# EAGLE board mcat-4cu-b-v2e (EAGLE 6.5.0)
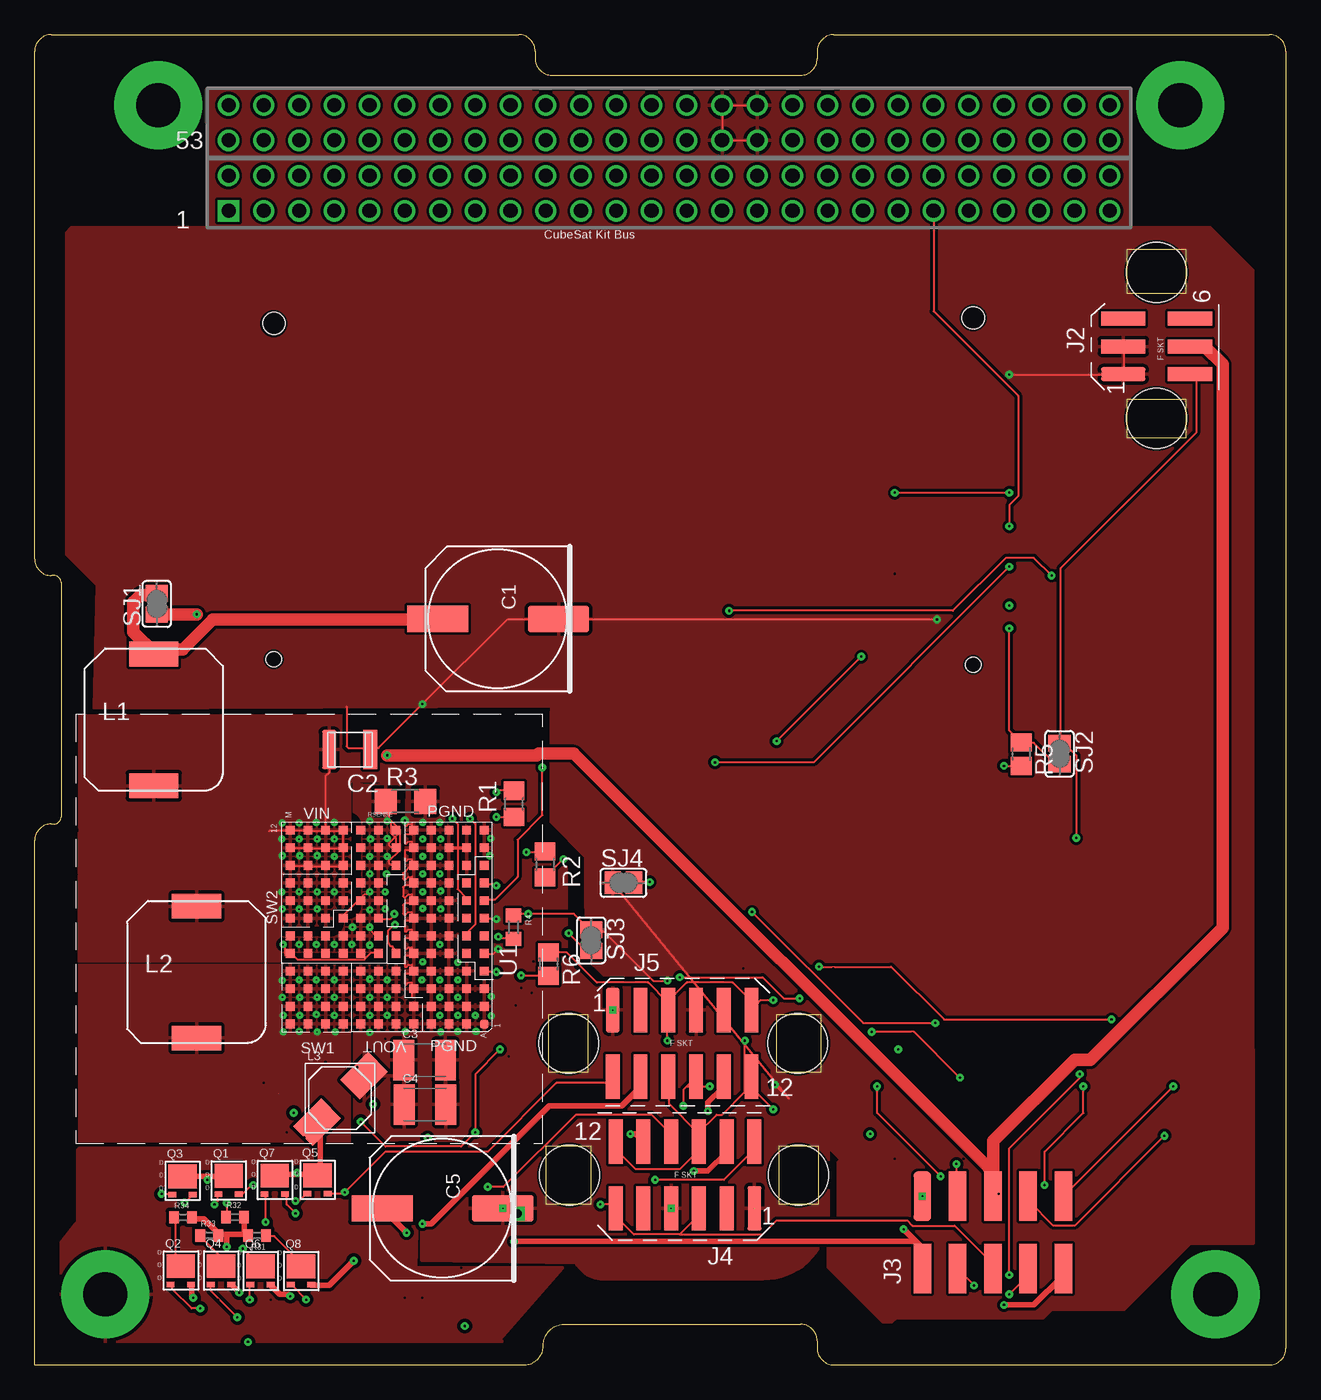
[diagram p5: board, top side]
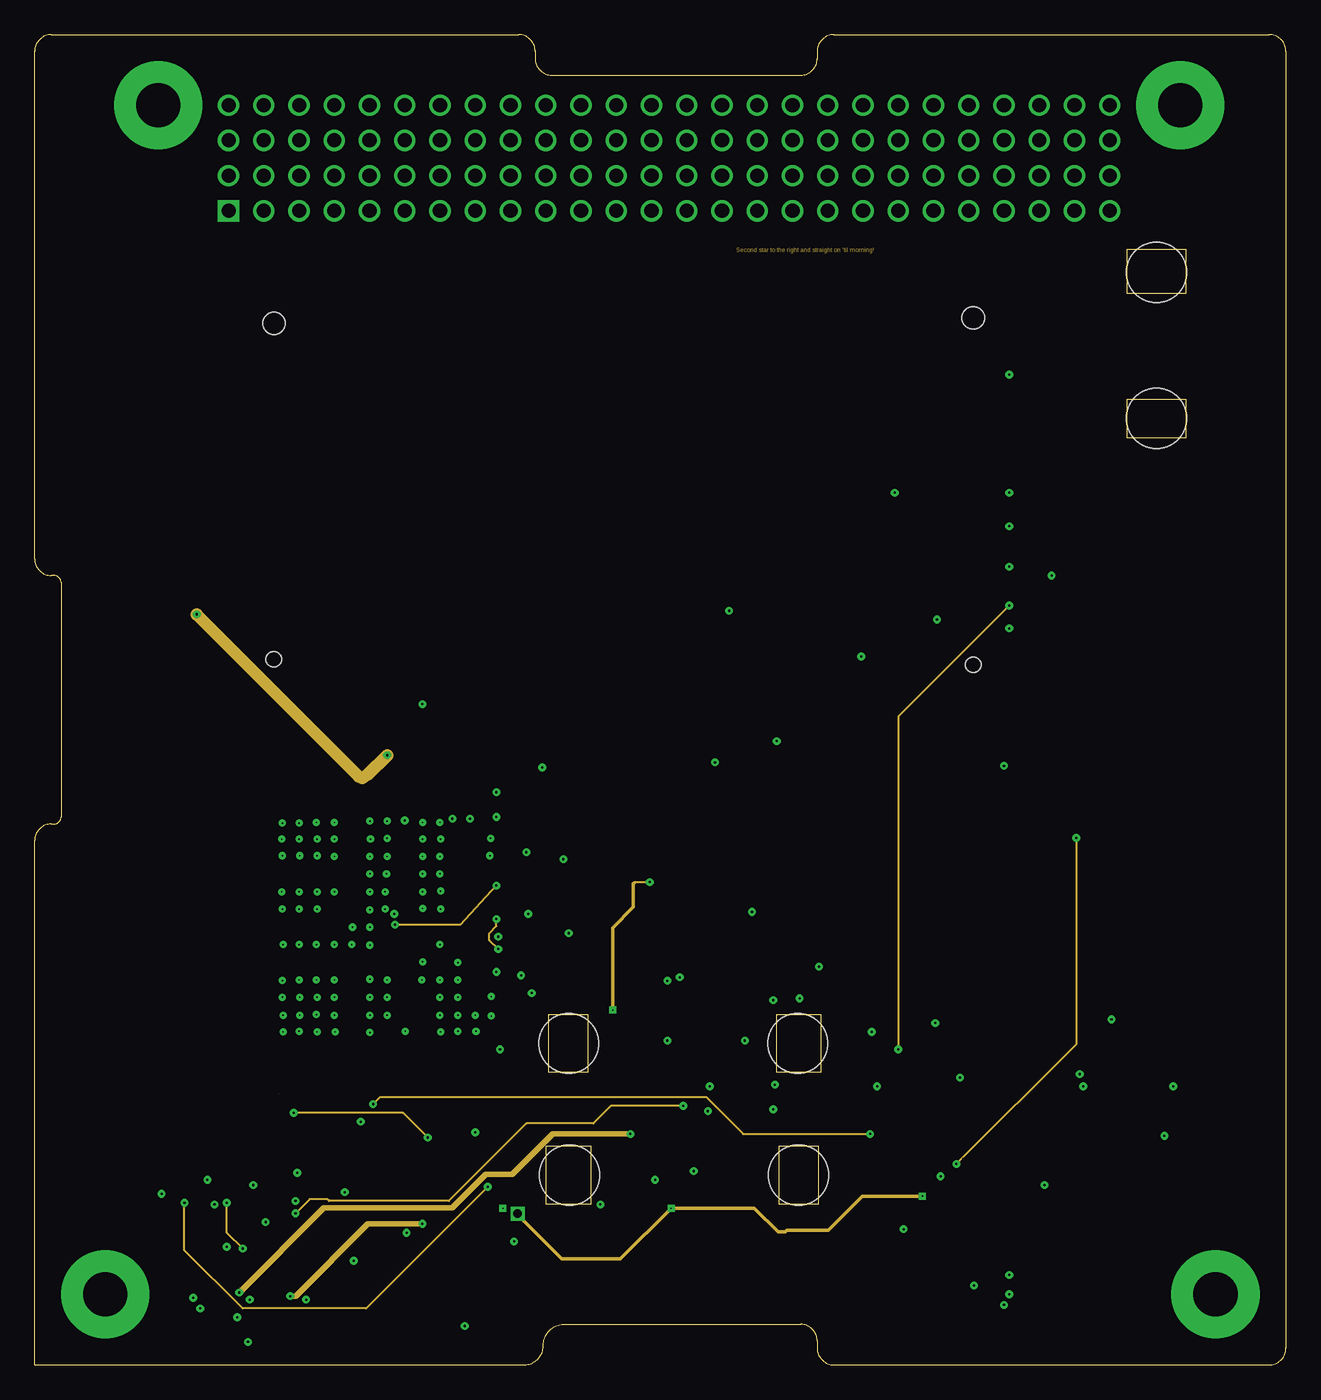
[diagram p6: board, inner layer Route2]
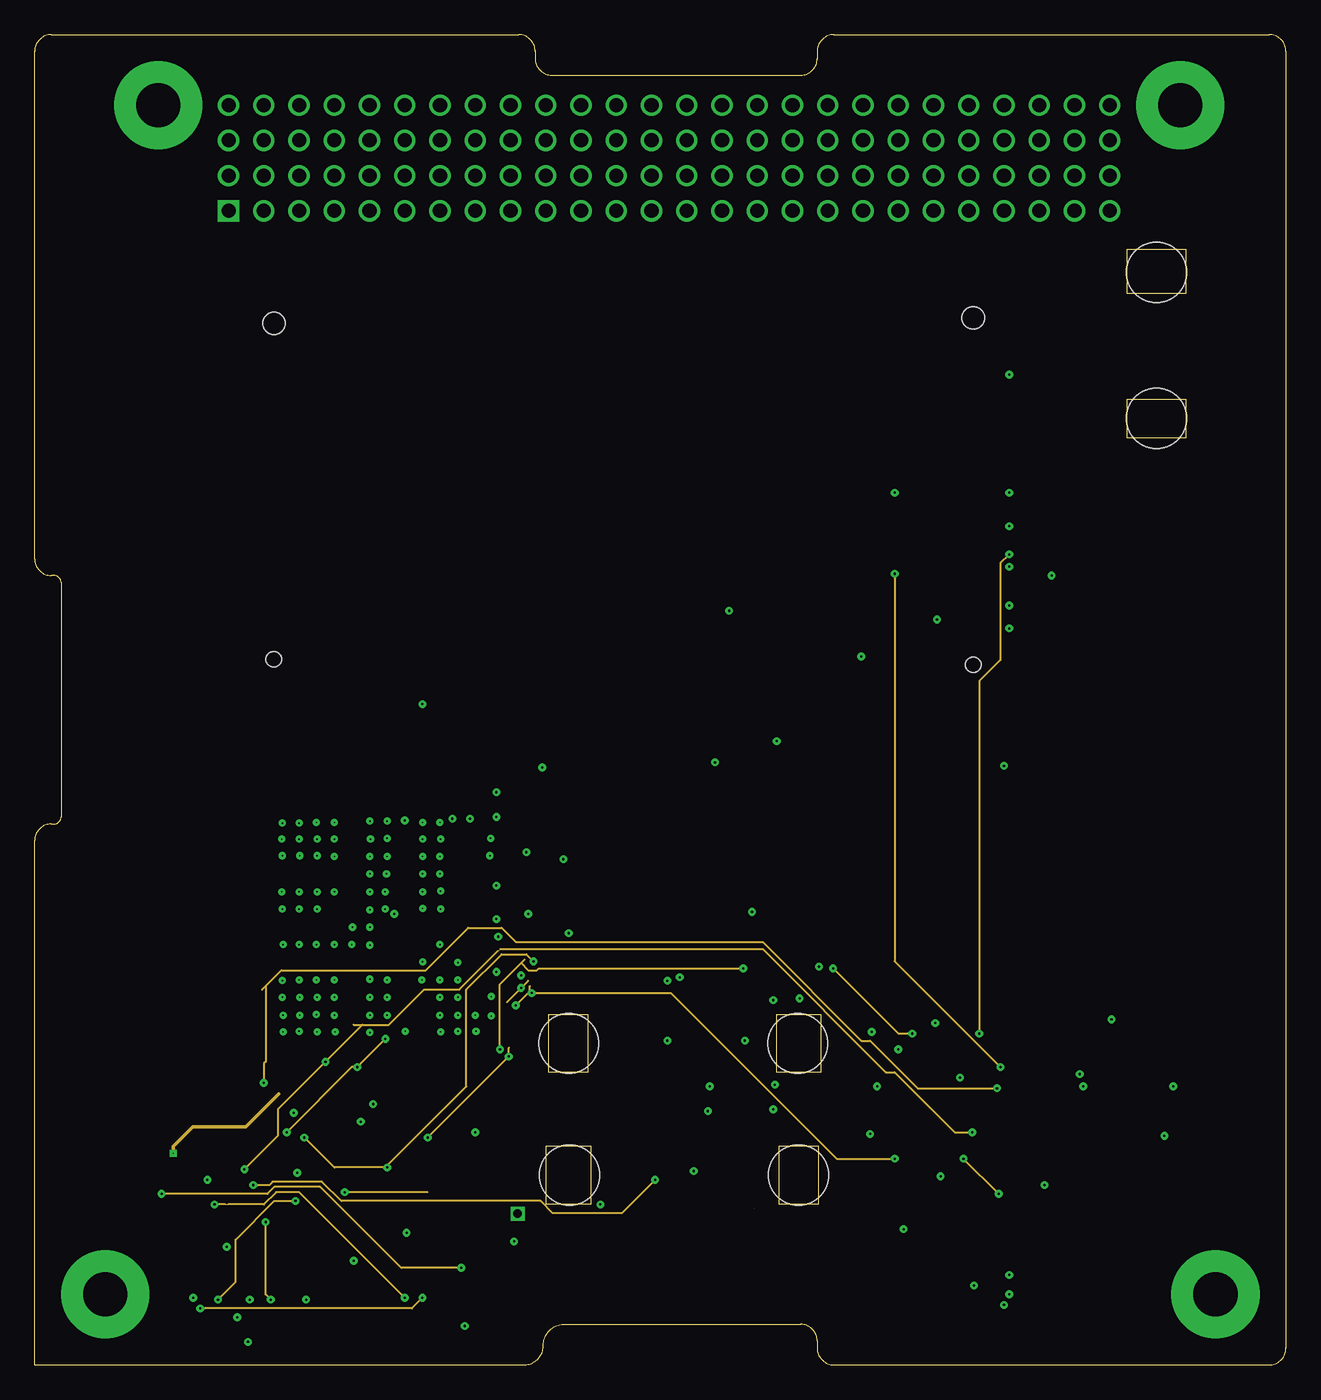
[diagram p7: board, inner layer Route15]
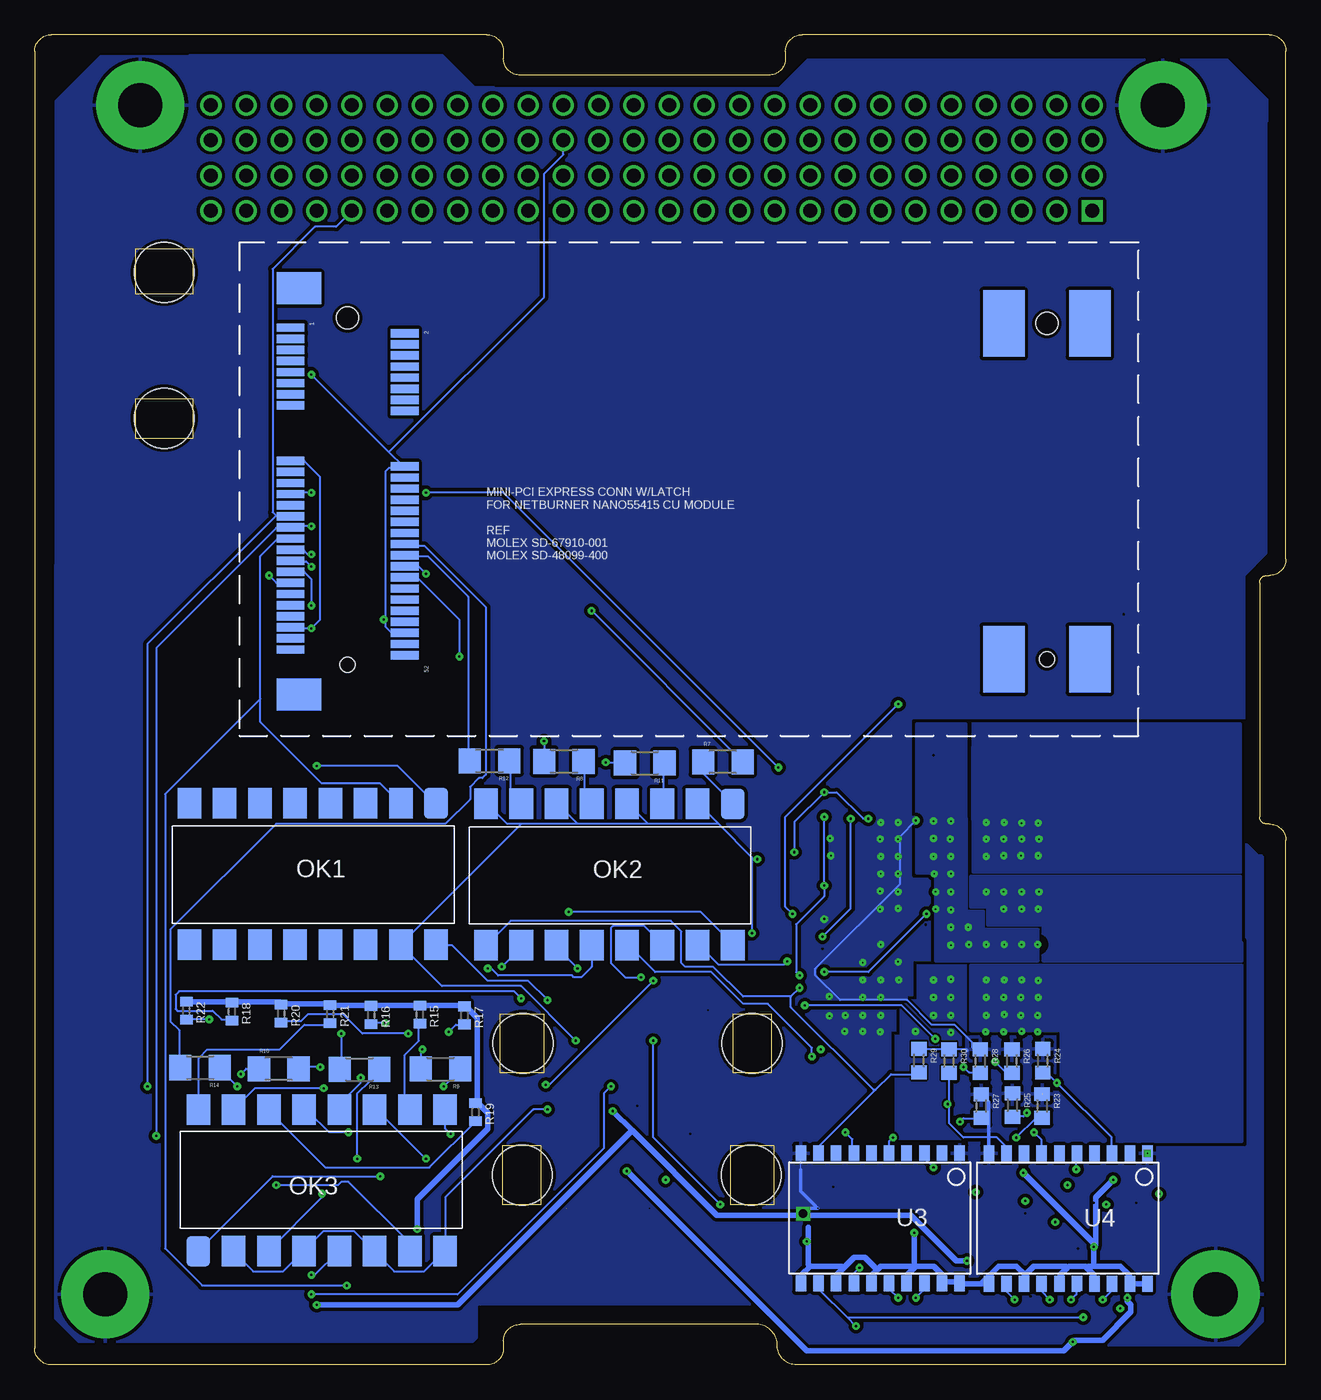
[diagram p8: board, bottom side, seen from below]

Size 90.17 x 95.89 mm. Coordinates in mm from the lower left corner, seen from the top.
Outline: 0,0 34.87,0 35.28,0 arc90 36.65,1.37 arc-90 38.12,2.92 55.19,2.92 arc-90 56.39,1.73 56.39,1.19 arc90 57.58,0 88.98,0 arc90 90.17,1.19 90.17,94.69 arc90 88.98,95.89 57.58,95.89 arc90 56.39,94.69 56.39,94.16 arc-90 55.19,92.96 37.26,92.96 arc-90 36.07,94.16 36.07,94.69 arc90 34.87,95.89 1.19,95.89 arc90 0,94.69 0,58.09 arc90 1.19,56.9 1.4,56.9 arc-90 1.91,56.39 1.91,39.5 arc-90 1.4,38.99 1.19,38.99 arc90 0,37.8 0,0
Copper layers [2:(1+(2*15)+16):15]: Top 0.035559375mm / dielectric 3.5mil / Route2 0.01778125mm / dielectric 47mil / Route15 0.01778125mm / dielectric 3.5mil / Bottom 0.035559375mm
Design rules "mcat-4cu-b-v2e *": minimum track width 6mil, minimum drill 4mil, track to track 6mil, track to pad 6mil, pad to pad 6mil, via to via 6mil, smd to smd 6mil, copper to edge 6.5mil, drill to drill 6.5mil, minimum pad ring 8mil, minimum via ring 8mil, stop-mask expansion 3mil, vias tented up to drill 0mil, thermal gap 10mil
Net classes: 0 default: clearance 0.205 mm; 1 vout1a2ozcu: width 0.406 mm; 2 vin2a2ozcu: width 0.889 mm
tRestrict: 27 lines

## Footprints (pad centres in the part's own frame; a part is rotated, then mirrored left to right if it is on the bottom)
OS-CON-SVPF-F12 = smd 1.9 x 4.4: A1 0,-4.3; K1 0,4.4
MLCC-X7R-1210 = smd 1 x 2.8: 1 1.6,0.05; 2 -1.35,0.05
C1210K = smd 1.5 x 2.9: 1 -1.5,0; 2 1.5,0
CSK_MOUNTING_HOLE = drill 3.175 pad 6.35: P$1 0,0
CSK-BUS-PKG = drill 1.016 pad 1.524 square: 1 -29.21,-3.81 | drill 1.016 pad 1.524: 2 -29.21,-1.27; 3 -26.67,-3.81; 4 -26.67,-1.27; 5 -24.13,-3.81; 6 -24.13,-1.27; 7 -21.59,-3.81; 8 -21.59,-1.27; 9 -19.05,-3.81; 10 -19.05,-1.27; 11 -16.51,-3.81; 12 -16.51,-1.27; 13 -13.97,-3.81; 14 -13.97,-1.27; 15 -11.43,-3.81; 16 -11.43,-1.27; 17 -8.89,-3.81; 18 -8.89,-1.27; 19 -6.35,-3.81; 20 -6.35,-1.27; 21 -3.81,-3.81; 22 -3.81,-1.27; 23 -1.27,-3.81; 24 -1.27,-1.27; 25 1.27,-3.81; 26 1.27,-1.27; 27 3.81,-3.81; 28 3.81,-1.27; 29 6.35,-3.81; 30 6.35,-1.27; 31 8.89,-3.81; 32 8.89,-1.27; 33 11.43,-3.81; 34 11.43,-1.27; 35 13.97,-3.81; 36 13.97,-1.27; 37 16.51,-3.81; 38 16.51,-1.27; 39 19.05,-3.81; 40 19.05,-1.27; 41 21.59,-3.81; 42 21.59,-1.27; 43 24.13,-3.81; 44 24.13,-1.27; 45 26.67,-3.81; 46 26.67,-1.27; 47 29.21,-3.81; 48 29.21,-1.27; 49 31.75,-3.81; 50 31.75,-1.27; 51 34.29,-3.81; 52 34.29,-1.27; 53 -29.21,1.27; 54 -29.21,3.81; 55 -26.67,1.27; 56 -26.67,3.81; 57 -24.13,1.27; 58 -24.13,3.81; 59 -21.59,1.27; 60 -21.59,3.81; 61 -19.05,1.27; 62 -19.05,3.81; 63 -16.51,1.27; 64 -16.51,3.81; 65 -13.97,1.27; 66 -13.97,3.81; 67 -11.43,1.27; 68 -11.43,3.81; 69 -8.89,1.27; 70 -8.89,3.81; 71 -6.35,1.27; 72 -6.35,3.81; 73 -3.81,1.27; 74 -3.81,3.81; 75 -1.27,1.27; 76 -1.27,3.81; 77 1.27,1.27; 78 1.27,3.81; 79 3.81,1.27; 80 3.81,3.81; 81 6.35,1.27; 82 6.35,3.81; 83 8.89,1.27; 84 8.89,3.81; 85 11.43,1.27; 86 11.43,3.81; 87 13.97,1.27; 88 13.97,3.81; 89 16.51,1.27; 90 16.51,3.81; 91 19.05,1.27; 92 19.05,3.81; 93 21.59,1.27; 94 21.59,3.81; 95 24.13,1.27; 96 24.13,3.81; 97 26.67,1.27; 98 26.67,3.81; 99 29.21,1.27; 100 29.21,3.81; 101 31.75,1.27; 102 31.75,3.81; 103 34.29,1.27; 104 34.29,3.81
M80-68106 = smd 1 x 3.2: 1 -2,2.4; 2 0,2.4; 3 2,2.4; 4 -2,-2.4; 5 0,-2.4; 6 2,-2.4 | hole 4.318: -5.175,0; 5.335,0
AMPMODU-SMT-PIN-HEADER-5X2 = smd 1.27 x 3.556: 1 -4.826,2.54; 2 -2.286,2.54; 3 0.254,2.54; 4 2.794,2.54; 5 5.334,2.54; 6 -4.826,-2.667; 7 -2.286,-2.667; 8 0.254,-2.667; 9 2.794,-2.667; 10 5.334,-2.667
M80-68112 = smd 1 x 3.2: 1 0,2.4; 2 2,2.4; 3 4,2.4; 4 6,2.4; 5 8,2.4; 6 10,2.4; 7 0,-2.4; 8 2,-2.4; 9 4,-2.4; 10 6,-2.4; 11 8,-2.4; 12 10,-2.4 | hole 4.318: -3.175,0; 13.335,0
MSS1048 = smd 3.56 x 1.78: 1 5,9.85; 2 5,0.35
SERIES-POWER-INDUCTORS = smd 2.85 x 2 rotated 45: 1 1.75,1.6; 2 -1.65,-1.75
PS2501L-4 = smd 2.2 x 1.7: 1 -1.6,19.03; 2 -1.6,16.49; 3 -1.6,13.95; 4 -1.6,11.41; 5 -1.6,8.87; 6 -1.6,6.33; 7 -1.6,3.79; 8 -1.6,1.25; 9 8.6,1.25; 10 8.6,3.79; 11 8.6,6.33; 12 8.6,8.87; 13 8.6,11.41; 14 8.6,13.95; 15 8.6,16.49; 16 8.6,19.03
1206-8-CHIPFET = smd 2.032 x 1.727: D 0,1.321 | smd 0.559 x 0.406: G -0.736,0; S 0.736,0
R0805 = smd 1.3 x 1.5: 1 -0.95,0; 2 0.95,0
R1206 = smd 1.6 x 1.803: 1 -1.422,0; 2 1.422,0
R0603 = smd 1 x 1.1: 1 -0.85,0; 2 0.85,0
R0805' = smd 1.3 x 1.5: 1 -0.85,0; 2 0.85,0
R0402 = smd 0.7 x 0.9: 1 -0.65,0; 2 0.65,0
SJ = smd 1.168 x 1.6: 1 -0.762,0; 2 0.762,0
LGA-141-LTC-05-08-1840-B = smd 0.63 x 0.63: A1 -7.116,-10.192; A2 -5.846,-10.192; A3 -4.576,-10.192; A4 -3.306,-10.192; A5 -2.036,-10.192; A6 -0.766,-10.192; A7 0.504,-10.192; A8 1.774,-10.192; A9 3.044,-10.192; A10 4.314,-10.192; A11 5.584,-10.192; A12 6.854,-10.192; B1 -7.116,-8.922; B2 -5.846,-8.922; B3 -4.576,-8.922; B4 -3.306,-8.922; B5 -2.036,-8.922; B6 -0.766,-8.922; B7 0.504,-8.922; B8 1.774,-8.922; B9 3.044,-8.922; B10 4.314,-8.922; B11 5.584,-8.922; B12 6.854,-8.922; C1 -7.116,-7.652; C2 -5.846,-7.652; C3 -4.576,-7.652; C4 -3.306,-7.652; C5 -2.036,-7.652; C6 -0.766,-7.652; C7 0.504,-7.652; C8 1.774,-7.652; C9 3.044,-7.652; C10 4.314,-7.652; C11 5.584,-7.652; C12 6.854,-7.652; D1 -7.116,-6.382; D2 -5.846,-6.382; D3 -4.576,-6.382; D4 -3.306,-6.382; D5 -2.036,-6.382; D6 -0.766,-6.382; D7 0.504,-6.382; D8 1.774,-6.382; D9 3.044,-6.382; D10 4.314,-6.382; D11 5.584,-6.382; D12 6.854,-6.382; E1 -7.116,-5.112; E2 -5.846,-5.112; E3 -4.576,-5.112; E4 -3.306,-5.112; E5 -2.036,-5.112; E6 -0.766,-5.112; E7 0.504,-5.112; E8 1.774,-5.112; E9 3.044,-5.112; E10 4.314,-5.112; E11 5.584,-5.112; E12 6.854,-5.112; F1 -7.116,-3.842; F2 -5.846,-3.842; F3 -4.576,-3.842; F4 -3.306,-3.842; F5 -2.036,-3.842; F6 -0.766,-3.842; F10 4.314,-3.842; F11 5.584,-3.842; F12 6.854,-3.842; G1 -7.116,-2.572; G2 -5.846,-2.572; G3 -4.576,-2.572; G4 -3.306,-2.572; G5 -2.036,-2.572; G6 -0.766,-2.572; G7 0.504,-2.572; G8 1.774,-2.572; G9 3.044,-2.572; G10 4.314,-2.572; G11 5.584,-2.572; G12 6.854,-2.572; H2 -5.846,-1.302; H3 -4.576,-1.302; H4 -3.306,-1.302; H5 -2.036,-1.302; H6 -0.766,-1.302; H7 0.504,-1.302; H8 1.774,-1.302; H9 3.044,-1.302; H10 4.314,-1.302; H11 5.584,-1.302; H12 6.854,-1.302; J5 -2.036,-0.032; J6 -0.766,-0.032; J7 0.504,-0.032; J8 1.774,-0.032; J9 3.044,-0.032; J10 4.314,-0.032; J11 5.584,-0.032; J12 6.854,-0.032; K5 -2.036,1.238; K6 -0.766,1.238; K7 0.504,1.238; K8 1.774,1.238; K9 3.044,1.238; K10 4.314,1.238; K11 5.584,1.238; K12 6.854,1.238; L5 -2.036,2.508; L6 -0.766,2.508; L7 0.504,2.508; L8 1.774,2.508; L9 3.044,2.508; L10 4.314,2.508; L11 5.584,2.508; L12 6.854,2.508; M5 -2.036,3.778; M6 -0.766,3.778; M7 0.504,3.778; M8 1.774,3.778; M9 3.044,3.778; M10 4.314,3.778; M11 5.584,3.778; M12 6.854,3.778; SW1@J1 -7.116,-0.032; SW1@J2 -5.846,-0.032; SW1@J3 -4.576,-0.032; SW1@J4 -3.306,-0.032; SW1@K1 -7.116,1.238; SW1@K2 -5.846,1.238; SW1@K3 -4.576,1.238; SW1@K4 -3.306,1.238; SW1@L1 -7.116,2.508; SW1@L2 -5.846,2.508; SW1@L3 -4.576,2.508; SW1@L4 -3.306,2.508; SW1@M1 -7.116,3.778; SW1@M2 -5.846,3.778; SW1@M3 -4.576,3.778; SW1@M4 -3.306,3.778; VOUT -7.116,-1.302
MOLEX-MINI-PCI-EXPRESS-8MM-52CKT = smd 0.6 x 2: 1 -11.65,-26.8; 2 -11.248,-18.576; 3 -10.85,-26.8; 4 -10.447,-18.576; 5 -10.05,-26.8; 6 -9.648,-18.576; 7 -9.25,-26.8; 8 -8.848,-18.576; 9 -8.45,-26.8; 10 -8.047,-18.576; 11 -7.65,-26.8; 12 -7.247,-18.576; 13 -6.85,-26.8; 14 -6.447,-18.576; 15 -6.05,-26.8; 16 -5.647,-18.576; 17 -2.05,-26.8; 18 -1.647,-18.576; 19 -1.25,-26.8; 20 -0.848,-18.576; 21 -0.45,-26.8; 22 -0.048,-18.576; 23 0.35,-26.8; 24 0.752,-18.576; 25 1.15,-26.8; 26 1.552,-18.576; 27 1.95,-26.8; 28 2.353,-18.576; 29 2.75,-26.8; 30 3.152,-18.576; 31 3.55,-26.8; 32 3.953,-18.576; 33 4.35,-26.8; 34 4.753,-18.576; 35 5.15,-26.8; 36 5.553,-18.576; 37 5.95,-26.8; 38 6.353,-18.576; 39 6.75,-26.8; 40 7.152,-18.576; 41 7.55,-26.8; 42 7.952,-18.576; 43 8.35,-26.8; 44 8.752,-18.576; 45 9.15,-26.8; 46 9.553,-18.576; 47 9.95,-26.8; 48 10.352,-18.576; 49 10.75,-26.8; 50 11.152,-18.576; 51 11.55,-26.8; 52 11.953,-18.576 | smd 2.3 x 3.2: P$1 -14.5,-26.2; P$2 14.8,-26.2 | smd 4.8 x 3: P$3 12.25,24.6; P$4 -11.95,24.6; P$5 -11.95,30.8; P$6 12.25,30.8 | hole 1.6: -12.35,-22.7; -11.95,27.7 | hole 1.1: 12.65,-22.7; 12.25,27.7
20-LEAD-PLASTIC-SO = smd 0.762 x 1.143: 1 0,0; 2 1.27,0; 3 2.54,0; 4 3.81,0; 5 5.08,0; 6 6.35,0; 7 7.62,0; 8 8.89,0; 9 10.16,0; 10 11.43,0; 11 11.43,9.398; 12 10.16,9.398; 13 8.89,9.398; 14 7.62,9.398; 15 6.35,9.398; 16 5.08,9.398; 17 3.81,9.398; 18 2.54,9.398; 19 1.27,9.398; 20 0,9.398

## Placement (x,y rotation side)
C1  68uF  [OS-CON-SVPF-F12]  33.35,53.77 270 top
C2  4.7uF  [MLCC-X7R-1210]  22.83,44.4 180 top
C3  10uF  [C1210K]  28.1,21.97 0 top
C4  10uF  [C1210K]  28.13,18.76 0 top
C5  68uF  [OS-CON-SVPF-F12]  29.34,11.28 270 top
H1  MOUNT-PAD-ROUNDCSK_MTG_HOLE_A5  [CSK_MOUNTING_HOLE]  8.89,90.81 0 top
H2  MOUNT-PAD-ROUNDCSK_MTG_HOLE_A5  [CSK_MOUNTING_HOLE]  82.55,90.81 0 top
H3  MOUNT-PAD-ROUNDCSK_MTG_HOLE_A5  [CSK_MOUNTING_HOLE]  85.09,5.08 0 top
HBL  MOUNT-PAD-ROUNDCSK_MTG_HOLE_A5  [CSK_MOUNTING_HOLE]  5.08,5.08 0 top
J1  2 x ESQ-126-39-G-D  [CSK-BUS-PKG]  43.18,87 0 top
J2  M80-6810642  [M80-68106]  80.84,73.41 90 top
J3  AMPMODU 5X2 SMT HDR  [AMPMODU-SMT-PIN-HEADER-5X2]  68.79,9.62 0 top
J4  M80-6811242  [M80-68112]  51.87,13.68 180 top
J5  M80-6811242  [M80-68112]  41.66,23.17 0 top
L1  33 uH  [MSS1048]  3.58,41.39 0 top
L2  330 uH  [MSS1048]  6.66,23.2 0 top
L3  10 uH  [SERIES-POWER-INDUCTORS]  21.99,19.23 0 top
OK1  PS2501L-4  [PS2501L-4]  80.28,38.88 270 bottom
OK2  PS2501L-4  [PS2501L-4]  58.9,38.84 270 bottom
OK3  PS2501L-4  [PS2501L-4]  59.34,9.79 90 bottom
Q1  SI5404BDC  [1206-8-CHIPFET]  13.98,12.3 0 top
Q2  SI5404BDC  [1206-8-CHIPFET]  10.53,5.8 0 top
Q3  SI5404BDC  [1206-8-CHIPFET]  10.65,12.27 0 top
Q4  SI5404BDC  [1206-8-CHIPFET]  13.42,5.8 0 top
Q5  SI5404BDC  [1206-8-CHIPFET]  20.38,12.34 0 top
Q6  SI5404BDC  [1206-8-CHIPFET]  16.27,5.77 0 top
Q7  SI5404BDC  [1206-8-CHIPFET]  17.3,12.32 0 top
Q8  SI5404BDC  [1206-8-CHIPFET]  19.19,5.77 0 top
R1  3K79  [R0805]  34.54,40.43 90 top
R2  1K  [R0805]  36.78,36.07 270 top
R3  70 mOhms  [R1206]  26.72,40.62 0 top
R4  4k7 0.1%  [R0603]  34.5,31.54 270 top
R5  1K  [R0805']  71.09,44.03 270 top
R6  604R  [R0805']  37.03,28.89 270 top
R7  5K42  [R1206]  40.58,43.47 0 bottom
R8  5K42  [R1206]  52.04,43.51 180 bottom
R9  5K42  [R1206]  60.94,21.32 180 bottom
R10  5K42  [R1206]  72.59,21.34 0 bottom
R11  5K42  [R1206]  46.21,43.37 180 bottom
R12  5K42  [R1206]  57.4,43.53 180 bottom
R13  5K42 0.1%  [R1206]  66.77,21.3 180 bottom
R14  5K42 0.1%  [R1206]  78.26,21.42 180 bottom
R15  R-US_R0402  [R0402]  62.42,25.24 270 bottom
R16  100K 0.1%  [R0402]  65.92,25.22 270 bottom
R17  100K 0.1%  [R0402]  59.2,25.19 270 bottom
R18  100K 0.1%  [R0402]  75.96,25.46 270 bottom
R19  100K 0.1%  [R0402]  58.41,18.22 270 bottom
R20  100K 0.1%  [R0402]  72.41,25.31 270 bottom
R21  100K 0.1%  [R0402]  68.87,25.28 270 bottom
R22  100K 0.1%  [R0402]  79.24,25.53 270 bottom
R23  51K 0.1%  [R0603]  17.57,18.66 270 bottom
R24  51K 0.1%  [R0603]  17.54,21.92 270 bottom
R25  51K 0.1%  [R0603]  19.71,18.72 270 bottom
R26  51K 0.1%  [R0603]  19.75,21.89 270 bottom
R27  51K 0.1%  [R0603]  21.97,18.65 270 bottom
R28  51K 0.1%  [R0603]  22.04,21.9 270 bottom
R29  51k 0.1%  [R0603]  26.45,21.93 270 bottom
R30  51k 0.1%  [R0603]  24.28,21.89 270 bottom
R31  0.1R 1% PTC  [R0402]  16.02,9.33 180 top
R32  0.1R 1% PTC  [R0402]  14.44,10.66 0 top
R33  0.1R 1% PTC  [R0402]  12.58,9.33 0 top
R34  0.1R 1% PTC  [R0402]  10.68,10.63 0 top
SJ1  0R  [SJ]  8.8,54.85 90 top
SJ2  0R  [SJ]  73.85,44.05 270 top
SJ3  0R  [SJ]  40.1,30.6 270 top
SJ4  0R  [SJ]  42.42,34.75 0 top
U1  LTM4609MPV#PBF  [LGA-141-LTC-05-08-1840-B]  22.2,31.69 90 top
U2  UCAT-4CU-B-CONTROL-UNITNANO55415  [MOLEX-MINI-PCI-EXPRESS-8MM-52CKT]  44.93,63.11 270 bottom
U3  LT1161ISW  [20-LEAD-PLASTIC-SO]  23.52,15.26 180 bottom
U4  LT1161ISW  [20-LEAD-PLASTIC-SO]  9.98,15.25 180 bottom

## Tracks (layer width: path | path; a pad name or v marks a point on that pad's centre or on a via)
CH1_P18H  (via drill 0.15)
  Top 0.406: v11.43,4.83 11.3,4.95 11.3,5.71 Q2.S | v47.5,13.97 48.51,13.97 49.78,15.24 49.78,16 J4.8
  Bottom 0.406: v11.43,4.83 11.43,4.57 11.18,4.32 11.18,3.81 13.21,1.78 15.24,1.78 v15.37,1.65 16,1.02 34.54,1.02 v47.5,13.97
CH1_P18L  (via drill 0.15)
  Top 0.152: v15.75,12.95 15.62,12.95 14.99,12.32 14.73,12.32 Q1.S | v44.7,13.34 49.66,13.34 51.82,15.49 51.82,16 J4.7
  Route15 0.152: v15.75,12.95 16.89,12.95 17.14,13.21 20.7,13.21 22.1,11.81 36.45,11.81 37.34,10.92 42.29,10.92 v44.7,13.34
CH1HG  (via drill 0.15, 0.15 layers 15-16)
  Top 0.152: v11.94,4.06 11.3,4.06 9.91,5.46 9.91,5.71 Q2.G
  Route15 0.152: v11.94,4.06 27.18,4.06 v27.94,4.83
  Bottom 0.152: v27.94,4.83 28.57,5.46 28.57,5.84 U3.16
CH1LG  (via drill 0.15, 0.15 layers 15-16)
  Top 0.152: v12.95,11.56 13.21,11.81 13.21,12.19 Q1.G
  Route15 0.152: v12.95,11.56 16.51,11.56 17.4,12.45 19.05,12.45 v26.67,4.83
  Bottom 0.152: v26.67,4.83 26.16,5.33 26.16,5.84 U3.18
CH1S
  Top 0.152: R34.1 10.16,10.54 10.16,7.49 10.41,7.24 Q2.D
CH2_P18H  (via drill 0.15 layers 1-2)
  Top 0.406: v14.73,5.21 14.22,5.71 Q4.S | v42.93,16.64 43.31,16.64 43.81,16.13 J4.11
  Route2 0.406: v14.73,5.21 20.83,11.3 30.1,11.3 32.51,13.72 34.42,13.72 37.34,16.64 v42.93,16.64
CH2_P18L  (via drill 0.15 layers 1-2)
  Top 0.152: v10.79,11.68 11.3,12.19 Q3.S | v32.64,12.83 33.78,12.83 38.99,18.03 44.45,18.03 45.85,16.64 45.85,16.13 J4.10
  Route2 0.152: v10.79,11.68 10.79,8.26 14.99,4.06 23.88,4.06 v32.64,12.83
CH2HG  (via drill 0.15)
  Top 0.152: v14.61,3.43 12.7,5.33 12.7,5.71 Q4.G
  Bottom 0.152: 31.62,3.43 33.66,5.46 33.66,5.84 U3.12 | 31.62,3.43 v30.99,2.79 | 31.62,3.43 v14.61,3.43
CH2LG  (via drill 0.15, 0.15 layers 15-16)
  Top 0.152: v9.14,12.32 9.91,12.32 Q3.G
  Route15 0.152: v9.14,12.32 16.76,12.32 17.27,12.83 20.57,12.83 26.42,6.99 v30.73,6.99
  Bottom 0.152: v30.73,6.99 31.24,6.48 31.24,5.97 U3.14
CH2S
  Top 0.152: R33.1 11.94,9.27 13.34,7.87 13.34,7.24 Q4.D
CH3_P18H  (via drill 0.15 layers 1-2)
  Top 0.406: v18.41,4.95 18.29,5.08 17.65,5.08 17.02,5.71 Q6.S | v27.94,10.16 28.57,10.16 37.08,18.67 42.29,18.67 43.56,19.94 43.56,20.7 J5.8
  Route2 0.406: v18.41,4.95 18.8,4.95 24,10.16 v27.94,10.16
CH3_P18L  (via drill 0.15)
  Top 0.152: Q5.S 21.21,12.32 22.23,12.32 v22.35,12.45 25.27,15.37 32.64,15.37 37.59,20.32 41.15,20.32 41.53,20.7 J5.7
  Route15 0.152: 28.32,12.45 v22.35,12.45
CH3HG  (via drill 0.15)
  Top 0.152: v15.49,4.7 15.49,5.71 Q6.G
  Bottom 0.152: v15.49,4.7 15.11,5.08 15.11,5.84 U4.16
CH3LG  (via drill 0.15, 0.15 layers 15-16)
  Top 0.152: v18.8,11.81 19.05,11.81 19.56,12.32 Q5.G
  Route15 0.152: v18.8,11.81 17.27,11.81 14.48,9.02 14.48,5.97 v13.21,4.7
  Bottom 0.152: v13.21,4.7 12.57,5.33 12.57,5.84 U4.18
CH3S  (via drill 0.15 layers 1-2)
  Top 0.152: v13.84,11.68 13.84,10.67 R32.1 | v14.99,8.38 16.26,7.11 Q6.D
  Route2 0.152: v13.84,11.68 13.84,9.53 v14.99,8.38
CH4_P18H  (via drill 0.15)
  Top 0.406: v22.99,7.49 21.21,5.71 19.94,5.71 Q8.S | v48.51,18.29 48.51,18.92 49.53,19.94 49.53,20.7 J5.11 | v69.85,4.32 72.01,4.32 74.04,6.35 74.04,6.86 J3.10
  Bottom 0.406: v22.99,7.49 23.75,7.49 27.05,10.79 41.02,10.79 47.12,16.89 | v48.51,18.29 47.12,16.89 | v69.85,4.32 59.69,4.32 47.12,16.89
CH4_P18L  (via drill 0.15, 0.15 layers 1-2)
  Top 0.152: v18.8,10.92 18.16,11.56 18.16,12.32 Q7.S | v46.74,18.67 46.74,19.81 46.99,20.07 | 46.99,20.07 47.62,20.7 J5.10 | v70.23,5.08 71.5,6.35 71.5,6.86 J3.9 | 46.99,20.07 v48.64,20.07
  Route2 0.152: v18.8,10.92 19.81,11.94 21.08,11.94 21.21,11.81 29.84,11.81 35.43,17.4 40.26,17.4 41.53,18.67 v46.74,18.67
  Bottom 0.152: v70.23,5.08 59.69,5.08 49.15,15.62 49.15,19.56 v48.64,20.07
CH4HG  (via drill 0.15)
  Top 0.152: v19.56,4.7 18.54,5.71 Q8.G
  Bottom 0.152: v19.56,4.7 20.19,5.33 20.19,5.84 U4.12
CH4LG  (via drill 0.15, 0.15 layers 15-16)
  Top 0.152: v16.64,10.29 16.64,12.32 Q7.G
  Route15 0.152: v16.64,10.29 16.64,5.08 v17.02,4.7
  Bottom 0.152: v17.02,4.7 17.65,5.33 17.65,5.84 U4.14
CH4S
  Top 0.152: R31.1 16.76,9.27 17.27,9.27 19.18,7.37 19.18,7.11 Q8.D
GND  (via drill 0.15)
  Top 0.152: R4.1 34.54,32.51 v35.56,32.51 38.86,32.51 40.01,31.37 SJ3.1 40.13,31.24 41.02,31.24 44.58,27.69 v45.59,27.69 | 22.48,47.45 22.48,44.58 22.61,44.45 24.13,44.45 C2.2 24.26,44.45 24.77,44.45 v27.94,47.62 34.04,53.72 37.72,53.72 C1.K1 37.85,53.72 v65.02,53.72 | v53.34,20.19 54.36,19.18 SJ4.1 | J1.83 J1.81 J1.82 J1.84 | J2.2 78.49,73.41 78.49,71.5 J2.1 78.36,71.37 v70.23,71.37
  Bottom 0.152: v53.34,20.19 53.09,20.19 v45.59,27.69 | v27.94,47.62 36.07,39.5 36.07,33.02 v35.56,32.51 | 64.9,53.72 64.9,64.39 64.64,64.64 63.63,64.64 U2.18 63.63,64.77 64.64,65.79 | 64.9,53.72 64.9,53.21 64.52,52.83 63.63,52.83 U2.48 | 64.64,65.79 v70.23,71.37 | J1.83 52.07,87.25 53.47,85.85 53.47,76.96 64.64,65.79 | 64.9,53.72 v65.02,53.72
  pour Top (isolate 0.1): 37.25,47.48 37.23,46.75 37.23,39.12 39.73,36.62 39.73,33.05 39.75,32.67 39.75,29.35 41,28.1 47.52,28.1 53.15,22.48 53.15,16.38 53.4,16.12 56.8,16.12 58.02,14.9 58.2,14.9 57.9,14.6 57.9,9.28 57.17,8.55 57.17,7.03 61.1,3.1 61.77,3.1 62.08,3.4 72.67,3.4 73.28,4 78.5,4 83.28,8.78 87.83,8.78 87.78,36.85 87.78,78.9 84.7,81.97 78.97,81.97 78.97,82.03 79,90.3 79,90.4 79,92 12.4,92 12.47,81.97 2.65,81.97 2.3,81.62 2.3,58.4 4.5,56.2 4.3,47.35
I2C(CLK)  (via drill 0.15)
  Top 0.152: v82.04,20.07 74.17,12.19 J3.5
  Bottom 0.152: 72.77,61.21 71.75,61.21 U2.27 | 72.77,61.21 73.03,61.47 73.03,78.99 69.98,82.04 68.45,82.04 J1.43 | v82.04,20.07 82.04,51.94 72.77,61.21
I2C(DATA)  (via drill 0.15)
  Top 0.152: v70.23,60.45 70.23,61.98 70.87,62.61 70.87,69.85 64.77,75.95 J1.41 | v81.41,16.51 74.93,10.03 73.41,10.03 71.63,11.81 71.63,12.06 J3.4
  Bottom 0.152: v70.23,60.45 71.63,60.45 U2.29 71.75,60.33 72.77,60.33 81.41,51.69 v81.41,16.51
INTVCC  (via drill 0.15, 0.15 layers 1-2)
  Top 0.152: v25.97,31.73 25.91,31.73 25.45,31.27 25.45,30.53 25.6,30.18 25.73,30.18 26.04,29.72 U1.F5 | v33.27,34.54 33.15,34.67 32.51,34.67 U1.A9 | v33.27,39.5 34.54,39.5 R1.1 | v35.05,28.07 36.96,28.07 R6.2
  Route2 0.152: v25.97,31.73 30.66,31.73 v33.27,34.54
  Bottom 0.152: v35.05,28.07 35.31,28.32 35.31,31.75 33.27,33.78 v33.27,34.54 v33.27,39.5
N$2
  cutout Top (isolate 0.254): 32.84,27.78 31.78,27.78 31.78,29.03 30.59,29.03 30.59,35.34 31.84,35.34 31.84,36.59 33.03,36.59 33.03,27.78 32.21,27.78
N$4  (via drill 0.15)
  Top 0.152: v64.9,24.64 59.69,24.64 v51.69,32.64
  Bottom 0.152: v64.9,24.64 65.91,24.64 R16.2 | v51.69,32.64 42.16,32.64 39.88,30.35 OK2.16
N$5  (via drill 0.15)
  Top 0.152: v55.12,26.42 53.98,26.42 52.45,27.94 v46.48,27.94
  Bottom 0.152: v55.12,26.42 55.63,26.92 79.76,26.92 80.01,26.67 80.01,25.65 79.88,25.53 77.34,25.53 76.71,24.89 76.07,24.89 R18.2 | v46.48,27.94 47.62,27.94 48.64,28.96 48.64,31.5 48.51,31.62 46.23,31.62 44.96,30.35 OK2.14
N$7  (via drill 0.15 layers 15-16)
  Route15 0.152: v63.25,23.88 62.23,23.88 v57.53,28.57
  Bottom 0.152: v63.25,23.88 66.55,23.88 67.94,25.27 70.48,25.27 70.99,24.77 72.39,24.77 R20.2 | v57.53,28.57 57.28,28.57 56.77,28.07 51.44,28.07 51.31,27.94 50.8,27.94 50.04,28.7 50.04,30.23 OK2.12
N$9  (via drill 0.15)
  Top 0.152: v77.6,24.89 65.53,24.89 61.72,28.7 v56.52,28.7
  Bottom 0.152: v77.6,24.89 79.12,24.89 R22.2 | v56.52,28.7 54.99,30.23 OK2.10
N$10
  Bottom 0.152: R21.2 68.96,24.51 70.74,24.51 72.52,22.73 77.72,22.73 78.36,22.1 78.36,18.41 OK3.16
N$11
  Bottom 0.152: R19.2 58.42,17.53 61.72,14.22 69.22,14.22 73.28,18.29 OK3.14
N$12  (via drill 0.15)
  Top 0.152: v60.33,24 63.37,24 v66.67,20.7
  Bottom 0.152: v60.33,24 59.82,24.51 59.31,24.51 R17.2 | v66.67,20.7 66.67,20.32 68.2,18.8 68.2,18.41 OK3.12
N$13
  Bottom 0.152: R15.2 62.48,24.51 62.48,23.37 63.5,22.35 63.5,18.67 63.25,18.41 OK3.10
N$16  (via drill 0.15)
  Top 0.152: v69.85,43.18 70.99,43.18 R5.2
  Bottom 0.152: v69.85,43.18 64.01,43.18 61.34,40.51 OK1.1
OK1E1  (via drill 0.15 layers 15-16)
  Route15 0.152: v19.43,16.38 21.59,14.22 25.27,14.22 | 25.27,14.22 31.11,20.07 31.11,27.05 33.66,29.59 35.43,29.59 v35.94,29.08 | 25.27,14.22 v25.4,14.22
  Bottom 0.152: v19.43,16.38 18.03,17.78 17.65,17.78 R23.2 | v25.4,14.22 26.04,14.86 26.04,15.24 U3.3 | v35.94,29.08 36.2,28.83 40.89,28.83 42.29,30.23 OK2.15
OK1E2  (via drill 0.15, 0.15 layers 15-16)
  Route2 0.152: v18.67,18.16 26.54,18.16 v28.32,16.38
  Route15 0.152: 34.16,22.86 v34.16,22.23 v28.32,16.38
  Bottom 0.152: v18.67,18.16 18.92,17.91 19.68,17.91 R25.2 | v28.32,16.38 28.57,16.13 28.57,15.37 U3.5 | v34.16,22.23 34.16,22.86 37.34,26.04 39.12,26.04 41.4,28.32 45.47,28.32 47.37,30.23 OK2.13
OK1E3  (via drill 0.15, 0.15 layers 15-16)
  Top 0.152: v33.53,22.73 31.75,20.95 v31.75,16.76 30.73,15.75 25.27,15.75 v23.5,17.53
  Route15 0.152: 35.05,28.96 33.53,27.43 v33.53,22.73 | 35.05,28.96 35.31,29.21 | v51.05,28.57 36.32,28.57 36.2,28.45 35.56,28.45 35.05,28.96
  Bottom 0.152: v23.5,17.53 23.24,17.78 21.97,17.78 R27.2 | v31.75,16.76 31.24,16.26 31.24,15.37 U3.7 | v51.05,28.57 52.45,29.97 52.45,30.23 OK2.11
OK1E4  (via drill 0.15 layers 15-16)
  Route15 0.152: 34.04,26.16 v35.05,27.18 35.56,27.69
  Bottom 0.152: 29.59,19.81 33.66,15.75 33.66,15.37 U3.9 | 29.59,19.81 28.45,20.95 26.54,20.95 R29.2 | 35.69,26.54 v35.05,27.18 | 35.69,26.54 35.69,25.78 29.72,19.81 29.59,19.81 | OK2.9 55.88,32 44.32,32 43.56,31.24 43.56,28.96 43.31,28.7 41.27,28.7 39.12,26.54 35.69,26.54
OK2E1  (via drill 0.15 layers 15-16)
  Route15 0.152: 16.38,27.05 16.64,27.3 | 16.64,27.3 17.78,28.45 28.19,28.45 31.24,31.5 33.66,31.5 34.67,30.48 52.45,30.48 59.56,23.37 60.2,23.37 63.63,19.94 v69.34,19.94 | v16.51,20.32 16.51,21.72 16.64,21.84 16.64,27.3
  Bottom 0.152: R24.2 17.53,20.95 17.14,20.95 v16.51,20.32 12.57,16.38 12.57,15.37 U4.3 | v69.34,19.94 74.3,19.94 75.82,18.41 OK3.15
OK2E2  (via drill 0.15 layers 15-16)
  Route15 0.152: 22.99,24.51 23.62,24.51 | 23.62,24.51 25.53,24.51 28.07,27.05 30.61,27.05 33.53,29.97 52.45,29.97 61.34,21.08 61.98,21.08 66.29,16.76 v67.56,16.76 | 23.62,24.51 v20.95,21.84 17.53,18.41 17.53,16.51 v15.11,14.1
  Bottom 0.152: v20.95,21.84 20.19,21.08 19.81,21.08 R26.2 | v15.11,14.1 15.11,15.24 U4.5 | v67.56,16.76 68.96,16.76 70.48,18.29 70.74,18.29 OK3.13
OK2E3  (via drill 0.15 layers 15-16, 0.15 layers 2-15)
  Route15 0.152: 35.69,26.92 35.69,27.3 | v34.67,25.91 35.69,26.92 | v25.27,23.5 v23.24,21.46 22.86,21.46 v18.16,16.76 | 35.69,26.92 v35.81,26.8 45.85,26.8 57.78,14.86 v61.98,14.86
  Bottom 0.152: v34.67,25.91 27.69,25.91 v25.27,23.5 | v23.24,21.46 22.86,21.08 22.1,21.08 R28.2 | v18.16,16.76 17.65,16.26 17.65,15.37 U4.7 | v61.98,14.86 65.41,18.29 65.66,18.29 OK3.11
OK2E4  (via drill 0.15)
  Route2 0.152: v60.2,16.64 51.05,16.64 48.39,19.3 24.89,19.3 v24.38,18.8
  Bottom 0.152: 24.26,18.8 24.26,17.4 23.24,16.38 20.83,16.38 20.19,15.75 20.19,15.37 U4.9 | 24.26,18.8 24.26,20.95 R30.2 | 24.26,18.8 v24.38,18.8 | v60.2,16.64 60.58,17.02 60.58,18.29 OK3.9
P3  (via drill 0.15)
  Top 0.152: SJ2.2 73.79,43.31 73.53,43.31 72.01,44.83 71.12,44.83 R5.1 70.99,44.96 70.23,45.72 v70.23,53.09
  Bottom 0.152: U2.47 71.63,53.09 v70.23,53.09 69.6,53.72 69.6,64.01 70.74,65.15 71.63,65.15 U2.17
P3_SW  (via drill 0.15 layers 1-2)
  Top 0.152: 73.91,45.09 73.91,57.4 83.69,67.18 83.69,70.99 83.31,71.37 J2.4 | 73.91,45.09 73.91,44.83 SJ2.1 73.91,45.09 | v66.42,14.48 66.42,12.19 J3.2 | v75.06,37.97 75.06,43.94 73.91,45.09
  Route2 0.152: v66.42,14.48 75.06,23.11 v75.06,37.97
P18_SW1
  Bottom 0.152: R7.1 41.91,43.43 41.91,42.55 39.88,40.51 OK2.1
P18_SW2
  Bottom 0.152: R8.1 50.55,43.43 50.55,41.02 50.04,40.51 OK2.5
P18_SW3  (via drill 0.15)
  Top 0.152: v60.71,20.07 60.71,18.16 v65.28,13.59
  Bottom 0.152: v60.71,20.07 59.56,21.21 R9.1 | v65.28,13.59 73.03,13.59 78.36,8.26 OK3.1
P18_SW4  (via drill 0.15)
  Top 0.152: v75.31,20.95 75.31,20.7 70.23,15.62 v70.23,6.48
  Bottom 0.152: v75.31,20.95 74.93,21.34 74.04,21.34 R10.1 | v70.23,6.48 69.98,6.48 68.33,8.13 OK3.5
P18_SW5
  Bottom 0.152: R11.1 44.83,43.31 44.83,40.51 OK2.3
P18_SW6
  Bottom 0.152: R12.1 55.88,43.43 55.88,41.27 55.12,40.51 OK2.7
P18_SW7  (via drill 0.15 layers 15-16)
  Route15 0.152: v69.47,12.32 v66.93,14.86
  Bottom 0.152: v66.93,14.86 66.93,19.56 66.04,20.45 66.04,20.57 65.41,21.21 R13.1 | v69.47,12.32 69.47,12.06 73.28,8.26 OK3.3
P18_SW8  (via drill 0.15)
  Top 0.152: v75.56,20.07 75.56,18.16 72.77,15.37 v72.77,12.95
  Bottom 0.152: v75.56,20.07 76.83,21.34 R14.1 | v72.77,12.95 68.33,12.95 68.07,13.21 67.56,13.21 63.25,8.89 63.25,8.26 OK3.7
PBATT_SW  (via drill 0.15 layers 1-2)
  Top 0.889: v11.68,54.1 8.89,54.1 SJ1.1 | 69.09,14.22 69.09,12.19 J3.3 | 69.09,14.22 69.09,16.13 74.93,21.97 76.07,21.97 85.6,31.5 85.6,72.14 84.33,73.41 83.31,73.41 J2.5 | v25.4,43.94 36.2,43.94 36.32,44.07 38.86,44.07 68.71,14.22 69.09,14.22
  Route2 0.889: v11.68,54.1 23.37,42.42 23.62,42.29 24,42.55 v25.4,43.94
PGND  (via drill 0.1 layers 1-2, 0.1 layers 15-16, 0.1 pad 0.25, 0.15, 0.15 layers 1-2, 0.6)  (2 unrouted)
  Top 0.152: 33.03,29.59 33.02,29.59 | 33.02,29.59 32.51,29.59 U1.A5 | v33.27,32.13 32.51,32.13 U1.A7 | 28.07,41.27 28.07,40.64 R3.2 | U1.B10 31.11,35.94 31.12,35.94 | U1.B12 31.11,38.48 31.12,38.48 | 27.18,26.53 27.18,27.56 26.92,27.56 26.8,27.43 26.67,27.43 26.67,28.19 27.18,28.19 27.18,28.83 26.92,28.83 26.8,28.7 26.67,28.7 26.67,29.46 27.18,29.46 27.18,30.1 26.92,30.1 26.8,29.97 26.67,29.97 26.67,30.73 27.18,30.73 27.18,31.37 26.92,31.37 26.8,31.24 26.67,31.24 26.67,32 27.18,32 27.18,32.64 26.92,32.64 26.67,32.38 26.54,32.51 26.54,33.15 26.67,33.27 27.18,33.27 27.18,33.91 26.92,33.91 26.67,33.66 26.54,33.78 26.54,34.42 26.67,34.54 27.18,34.54 27.18,35.18 26.92,35.18 26.67,34.92 26.54,35.05 26.54,35.43 27.18,36.07 27.18,36.45 26.92,36.45 26.8,36.32 26.67,36.32 26.67,37.08 27.18,37.08 27.18,37.72 26.92,37.72 26.8,37.59 26.67,37.59 26.67,38.23 27.18,38.23 27.18,38.99 26.92,38.99 26.8,38.86 26.67,38.86 v26.67,39.24 | v33.4,29.97 33.02,29.59 | C3.2 29.59,21.84 | 31.11,37.34 U1.B11 | v44.32,34.8 43.31,34.8 SJ4.2 | 47.75,25.27 J5.4 | 29.59,18.92 C4.2
  Top 0.254: U1.C11 U1.B11
  Route2 0.152: v33.27,32.13 33.27,31.62 32.77,31.11 32.77,30.61 v33.4,29.97 | v44.32,34.8 43.31,34.8 SJ4.2
  Route2 0.254: v34.8,10.9 34.8,10.8 37.98,7.62 42.21,7.62 J4.4 J4.1 53.57,9.57 54.08,9.57 54.2,9.7 57.17,9.7 59.63,12.15 v63.97,12.15 | J5.1 41.66,31.51 43.15,33 43.15,34.71 SJ4.2
  Route15 0.254: U4.1 9.98,15.76 11.38,17.15 15.21,17.15 R23.1
  Bottom 0: 34.95,14.05 U3.10
  Bottom 0.152: 8.89,89.66 H1.P$1 | 22.97,22.62 22.99,22.73 24.26,22.73 R30.1 24.38,22.73 26.42,22.73 R29.1 | R28.1 22.1,22.73 22.16,22.62 | v26.67,39.24 27.81,38.1 27.81,34.67 33.91,28.57 33.91,28.07 32.13,26.29 27.3,26.29 25.53,24.51 23.88,24.51 22.61,23.24 22.61,22.87 | 10.03,15.37 U4.1
  Bottom 0.254: 34.95,14.05 34.95,12.5 C5.K1 34.42,11.28 v34.8,10.9 | U4.10 21.41,18.95 R27.1
  other vias: 29.25,24 30.5,24.05 31.8,24.05 32.9,25.15 31.75,25.2 30.5,25.2 29.2,25.2 29.2,27.75 30.5,27.75 30.5,26.5 29.2,26.5 27.9,27.75 27.95,29.05 30.5,29 29.2,30.3 29.25,32.85 29.25,34.15 27.95,34.1 27.95,32.9 27.95,35.4 29.2,35.4 27.95,36.65 29.2,36.65 27.95,39.1 29.2,39.1 29.25,37.9 27.95,37.9 32.85,37.95 32.8,36.7 32.9,26.55 45.87,11.28 33.74,11.28 9.98,15.25 41.66,25.57
  pour Top (isolate 0.1): 22.9,46.78 36.5,46.8 36.6,46.8 arc-90 38.3,45.1 38.3,29.9 arc90 38.4,29.8 38.4,29.6 arc90 40,28 53.8,28 arc-90 54.7,27.1 54.7,24.3 arc90 55.4,23.6 arc90 55.5,23.5 55.7,23.5 arc-90 57.2,22 57.2,10.9 arc-90 52.5,6.2 40.95,6.2 arc-61 39.02,7.34 27.9,7.54 27.9,22.15 28.03,26.53 26.78,26.53 26.78,29.03 26.77,29.03 26.78,29.15 26.78,36.97 26.84,42.09 22.9,42.09
  pour Bottom (isolate 0.25, rank 6): 3.4,1.45 34.2,1.45 37.15,4.4 58.2,4.4 58.35,4.25 58.35,1.95 58.6,1.7 58.8,1.7 87,1.7 88.65,3.35 88.65,7.05 88.65,15.45 88.65,57.65 88.6,57.7 88.6,91.1 85.4,94.3 79.05,94.3 79,94.35 60.8,94.35 58.5,92.05 57.1,92.05 57.05,92 36.5,92 34.45,94.05 32,94.05 4.25,94.05 1.4,91.2 1.4,89.65 1.45,89.6 1.45,58.5 3.05,56.9 3.05,55.45 3.05,37.7 2.05,36.7 1.8,36.7 1.7,36.6 1.7,30.3 1.7,4 1.7,3.15
  pour Top (isolate 0.25): 3.1,10.3 2.9,10.1 1.75,8.6 1.75,3.3 3.4,1.65 33.7,1.7 33.35,1.8 33.5,1.8 38,6.95 38.05,7 27.48,7 27.6,12.3 26.85,13.05 26.85,13.15 24.4,15.6 3.2,15.6 3.1,15.5
RSENSE  (via drill 0.1 pad 0.25, 0.15)
  Top 0.152: v33.27,28.32 32.51,28.32 U1.A4 | v25.91,32.51 25.91,32.38 25.65,32.13 24.89,32.13 U1.G7 | U1.G5 24.77,29.72 24.26,29.72 23.75,29.21 18.92,29.21 18.67,29.46 18.16,29.46 18.03,29.59 18.03,30.23 v17.9,30.3 | U1.G6 24.77,30.99 24.51,30.99 24.13,31.37 v24.15,31.55 | U1.J7 22.35,32.26 22.35,32.51 23.75,33.91 24.13,33.91 v24.15,34.1 | 26.04,37.34 25.65,37.34 25.53,37.47 25.53,37.59 26.16,38.23 26.16,38.48 U1.F12 | U1.F10 26.04,36.07 25.65,36.07 25.53,36.2 25.53,36.32 26.29,37.08 26.29,38.61 25.53,39.37 25.53,39.88 25.4,40.01 R3.1 | 26.04,37.34 26.04,37.97 25.65,38.35 25.65,39.12 25.4,39.37 v25.4,39.2 | 26.04,37.34 U1.F11
  Bottom 0.152: v33.27,28.32 30.1,28.32 v25.91,32.51
  other vias: 19.05,30.3 20.3,30.3 21.6,30.3 22.9,31.55 22.9,31.55 22.85,30.3 24.15,30.25 24.15,32.8 24.15,32.8 24.15,35.4 25.25,34.1 25.25,32.85 25.35,35.4 25.4,36.65 24.15,36.65 25.4,37.95 24.2,37.9 24.15,39.2
  pour Top (isolate 1): 17.9,29.03 17.9,31.4 21.65,31.4 21.65,32.65 23,32.63 22.95,42 26.75,42 26.65,35.4 25.34,35.4 25.34,29.03
  pour Bottom (isolate 0.25): 17.9,31.4 21.82,31.4 21.82,32.67 23.05,32.7 23.07,46.2 26.6,46.2 26.6,35.45 25.25,35.45 25.25,29.12 17.9,29.12
SETFREQ  (via drill 0.15)
  Top 0.152: v30.1,39.37 30.48,38.99 30.48,34.29 31.11,33.66 31.11,33.53 U1.B8 | v33.27,41.27 33.4,41.4 34.54,41.4 R1.2 | v35.43,36.96 36.7,36.96 R2.1
  Bottom 0.152: v30.1,39.37 30.48,39.37 32.38,41.27 v33.27,41.27 35.43,39.12 v35.43,36.96
SGND  (via drill 0.15)
  Top 0.152: v38.1,36.45 36.83,35.18 R2.2 | v38.48,31.11 39.75,29.84 40.01,29.84 SJ3.2 | J4.12 41.91,16 41.91,15.49 43.31,14.1 46.48,14.1 47.75,15.37 47.75,16 J4.9 | 47.75,16.64 47.75,16.13 J4.9 | 47.75,16.64 47.75,16.76 45.72,18.8 45.72,20.7 J5.9 | 51.56,20.07 51.56,20.7 J5.12 | 51.18,19.68 49.53,18.03 49.15,18.03 47.75,16.64 | 51.18,19.68 51.56,20.07 | 47.75,16.64 J4.9 | 51.56,20.07 v53.21,18.41 | 51.56,20.07 J5.12 | 51.18,19.68 v51.18,23.37 | 51.18,19.68 J5.12
  Bottom 0.152: v38.1,36.45 38.35,36.45 38.48,36.58 | 40.89,38.99 42.29,40.39 OK2.2 | 40.89,38.99 38.48,36.58 | 38.48,36.58 v38.48,31.11 | 45.97,38.99 47.37,40.39 OK2.4 | 40.89,38.99 45.97,38.99 | 51.05,38.99 52.45,40.39 OK2.6 | 45.97,38.99 51.05,38.99 | 51.05,38.99 55.12,38.99 | 55.12,38.99 56.13,38.99 57.53,40.39 OK2.8 | 55.12,38.99 63.75,30.35 OK1.15 63.75,30.23 60.83,27.3 55.12,27.3 v51.18,23.37 | OK3.2 75.82,8.13 74.42,6.73 72.26,6.73 70.87,8.13 OK3.4 70.74,8.26 69.34,9.65 67.18,9.65 65.79,8.26 OK3.6 65.66,8.13 64.26,6.73 62.1,6.73 60.71,8.13 OK3.8 60.58,8.26 60.58,12.06 54.23,18.41 v53.21,18.41
SW1  (via drill 0.1 pad 0.25)
  other vias: 17.85,27.7 19.05,27.75 20.3,27.75 21.6,27.75 21.6,26.5 21.6,25.2 20.3,25.25 19.1,25.2 17.9,25.2 17.85,26.5 19.1,26.5 20.35,26.5 17.9,24 19.05,24.05 19.05,24.05 20.35,24 21.65,24
  pour Top (isolate 0.254): 22.78,28.9 3.15,28.9 3.15,16.03 22.78,16.03
  pour Bottom (isolate 0.012): 22.7,28.8 20.4,28.8 3.2,28.8 3.2,28.4 3.2,27.1 3.2,20.9 3.2,18.4 3.2,16.1 16.2,16.1 16.2,24.1 22.7,24.1 22.7,24.4
SW2  (via drill 0.1 pad 0.25)
  other vias: 17.8,34.1 19.05,34.1 20.35,34.1 21.6,34.1 20.35,32.85 19.05,32.85 17.85,32.85
  pour Top (isolate 0.254): 17.65,29.03 17.65,31.65 21.4,31.65 21.4,32.9 22.78,32.9 22.78,35.28 3.15,35.28 3.15,29.03
  pour Bottom (isolate 0.5): 22.7,35.2 22.7,33 21.5,33 21.5,32.8 21.5,31.7 17.6,31.7 17.5,31.7 17.5,29.1 3.2,29.1 3.2,30.4 3.3,30.4 3.3,35.2
SW_P18H1  (via drill 0.15)
  Top 0.152: v49.02,43.43 56.13,43.43 v70.23,57.53
  Bottom 0.152: v49.02,43.43 47.75,43.43 R11.2 | v70.23,57.53 70.61,57.91 71.63,57.91 U2.35
SW_P18H2
  Bottom 0.152: R12.2 58.93,43.56 58.93,55.37 61.85,58.29 63.5,58.29 U2.34
SW_P18H3  (via drill 0.15 layers 15-16)
  Route15 0.152: v68.07,23.88 68.07,49.28 69.6,50.8 69.6,57.78 v70.23,58.42
  Bottom 0.152: v68.07,23.88 68.07,21.34 R13.2 | v70.23,58.42 70.48,58.42 70.74,58.67 71.63,58.67 U2.33
SW_P18H4
  Bottom 0.152: R14.2 79.76,21.46 79.76,24.13 80.39,24.77 80.39,31.37 72.77,38.99 60.58,38.99 58.8,40.77 58.8,41.66 58.17,42.29 57.91,42.29 57.66,42.55 57.66,54.61 62.1,59.05 63.5,59.05 U2.32
SW_P18L1  (via drill 0.15)
  Top 0.152: v50.04,54.36 66.17,54.36 69.98,58.17 72.01,58.17 v73.28,56.9
  Bottom 0.152: v50.04,54.36 39.24,43.56 R7.2 | v73.28,56.9 72.77,56.39 71.75,56.39 U2.39
SW_P18L2  (via drill 0.15)
  Top 0.152: v59.56,51.05 v53.47,44.96
  Bottom 0.152: v53.47,44.96 53.47,43.56 R8.2 | v59.56,51.05 59.56,53.72 62.48,56.64 63.5,56.64 U2.38
SW_P18L3  (via drill 0.15)
  Route2 0.152: v62.23,22.73 62.23,46.74 v70.23,54.74
  Bottom 0.152: v62.23,22.73 62.36,22.61 62.36,21.34 R9.2 | v70.23,54.74 70.23,56.64 70.74,57.15 71.63,57.15 U2.37
SW_P18L4  (via drill 0.15 layers 15-16)
  Route15 0.152: v69.6,21.46 61.98,29.08 v61.98,57.02
  Bottom 0.152: v69.6,21.46 71.12,21.46 R10.2 | v61.98,57.02 62.48,57.53 63.5,57.53 U2.36
SW_RUNPMA  (via drill 0.15)
  Top 0.152: U1.A8 32.51,33.53 33.15,33.53 34.8,35.18 34.8,37.85 36.58,39.62 v36.58,43.05 | v61.98,62.87 v70.23,62.87
  Bottom 0.152: v70.23,62.87 71.63,62.87 U2.23 | v61.98,62.87 56.39,62.87 v36.58,43.05
SW_TP1  (via drill 0.15)
  Top 0.152: v67.69,5.71 66.55,6.86 J3.7
  Bottom 0.152: U2.31 72.64,59.56 73.91,58.29 73.91,48.01 | 73.91,48.01 73.91,46.35 69.47,41.91 65.28,41.91 63.88,40.51 OK1.2 | v67.69,5.71 78.11,5.71 80.77,8.38 80.77,41.15 73.91,48.01
TP1_OUT  (via drill 0.15)
  Top 0.152: 45.59,26.16 44.2,27.56 40.51,27.56 38.35,29.72 37.08,29.72 R6.1 | 45.59,26.16 45.59,25.65 J5.3 | v53.21,26.29 52.32,26.29 51.94,25.91 | 51.94,25.91 51.69,25.65 J5.6 51.94,25.91 | 45.59,26.16 46.99,27.56 50.29,27.56 51.94,25.91 | 45.59,26.16 J5.3 | 46.48,9.4 43.18,9.4 41.91,10.67 41.91,11.18 J4.6 41.78,11.3 41.53,11.56 v40.77,11.56 | 46.48,9.4 47.75,10.67 47.75,11.18 | 46.48,9.4 52.45,9.4 53.47,10.41 62.87,10.41 63.25,10.03 66.29,10.03 68.96,7.37 68.96,6.99 J3.8 | v45.59,23.37 45.59,25.53 J5.3
  Top 0.254: 47.75,11.18 J4.3
  Bottom 0.152: v53.21,26.29 54.61,27.69 57.53,27.69 60.07,30.23 61.21,30.23 OK1.16 | v45.59,23.37 45.59,16.38 v40.77,11.56
VBATT_IN
  Top 0.889: SJ1.2 8.76,55.5 7.62,55.5 7.11,54.99 7.11,52.83 8.64,51.31 L1.1 9.02,51.56 10.67,51.56 12.83,53.72 28.96,53.72 C1.A1
VFB  (via drill 0.15)
  Top 0.152: v31.37,39.37 31.75,38.99 31.75,31.75 31.24,31.24 31.24,30.99 U1.B6 | v33.4,30.86 33.53,30.73 34.42,30.73 R4.2
  Bottom 0.152: v31.37,39.37 31.37,32.89 v33.4,30.86
VIN  (via drill 0.1 pad 0.25)
  Top 0.1: 22.23,37.21 22.23,36.07
  Top 0.152: U1.K12 20.95,38.48 19.81,38.48 U1.L12 19.68,38.48 18.54,38.48 U1.M12 18.41,38.48 16.89,38.48 | 22.23,38.48 21.08,38.48 U1.K12 | U1.M10 18.54,35.94 19.68,35.94 U1.L10 19.81,35.94 20.95,35.94 U1.K10 21.08,35.94 22.23,35.94 U1.J10 22.23,36.07 | U1.M11 18.54,37.21 19.68,37.21 U1.L11 19.81,37.21 20.95,37.21 U1.K11 21.08,37.21 22.23,37.21 U1.J11 22.23,37.34 22.23,38.48 | 22.23,38.48 U1.J12 | U1.K12 20.95,38.61 20.95,42.42 21.21,42.67 21.21,44.32 C2.1
  other vias: 19.05,37.9 17.8,37.9 20.35,37.9 21.6,37.9 21.6,39.1 20.3,39.1 19.05,39.05 17.85,39.05 17.85,36.7 19.1,36.7 20.35,36.7 21.6,36.65
  pour Bottom (isolate 0.5): 22.52,35.52 22.57,43 22.55,46.23 3.3,46.2 3.3,35.5
  pour Top (isolate 0.254): 22.78,35.4 22.78,46.84 3.15,46.88 3.15,35.4
VOUT  (via drill 0.1 pad 0.25)
  other vias: 24.15,23.95 26.7,24.05 25.4,25.2 24.15,25.2 24.15,26.5 25.4,26.5 24.15,27.8 25.4,27.75
  pour Top (isolate 0.254): 22.96,28.84 22.96,16.03 27.8,16.13 27.8,18.44 27.84,22.78 27.84,26.34 26.59,26.34 26.59,28.84
  pour Bottom: 23,28.85 26.6,28.85 26.6,26.35 26.65,26.35 27.85,26.35 27.85,23.8 28.2,23.8 28.2,16.9 28.2,16.2 23.35,16.2 23.35,23.75 23,23.75 23,24.95
VOUTA  (via drill 0.15)
  Top 0.406: 20.45,17.4 L3.2 20.57,17.27 20.57,13.72 Q5.D 20.32,13.72 18.92,13.72 | 18.92,13.72 17.4,13.72 Q7.D | 13.84,9.4 15.37,9.4 R31.2 15.11,9.53 15.11,10.54 R32.2 | 13.84,9.4 13.34,9.4 R33.2 13.21,9.53 12.19,10.54 11.43,10.54 R34.2 | v13.84,8.51 13.84,9.4 | 12.45,13.59 13.97,13.59 Q1.D | 12.45,13.59 10.67,13.59 Q3.D | v12.45,13.34 12.45,13.59 | v18.92,13.84 18.92,13.72 | v26.8,9.53 25.15,11.18 C5.A1 | v62.61,9.78 63.37,9.02 | 63.37,9.02 63.88,8.51 63.88,6.99 J3.6 | v34.54,8.89 63.25,8.89 63.37,9.02
  Bottom 0.406: U4.20 10.03,5.84 11.18,5.84 U4.19 11.3,5.97 11.3,6.48 11.94,7.11 13.84,7.11 | 14.35,6.99 14.48,7.11 15.62,7.11 15.75,6.99 | 14.35,6.99 13.84,6.48 13.84,5.97 U4.17 | 15.75,6.99 16.26,6.48 16.26,5.97 U4.15 | 18.8,6.48 18.8,5.97 U4.13 | 18.8,6.48 18.16,7.11 15.88,7.11 15.75,6.99 | 13.84,7.11 14.22,7.11 14.35,6.99 | 21.84,5.84 23.5,5.84 U3.20 23.62,5.97 24.77,5.97 U3.19 24.64,6.1 24.64,6.35 25.4,7.11 26.67,7.11 | 21.84,5.84 21.46,5.84 U4.11 | 26.67,7.11 26.8,6.99 | 26.8,6.99 27.3,6.48 27.3,5.97 U3.17 | 29.46,6.86 29.21,7.11 26.92,7.11 26.8,6.99 | 29.46,6.86 29.84,6.48 29.84,5.97 U3.15 | 31.88,6.99 31.11,7.75 30.35,7.75 29.46,6.86 | 31.88,6.99 32.38,6.48 32.38,5.97 U3.13 | 34.29,7.11 34.92,6.48 34.92,5.97 U3.11 | 34.29,7.11 32,7.11 31.88,6.99 | 18.8,6.48 19.43,7.11 20.7,7.11 21.84,5.97 21.84,5.84 | v13.84,8.51 13.84,7.11 | 34.42,9.91 34.42,8.89 | 34.42,8.89 34.42,7.24 34.29,7.11 | v12.45,13.34 13.72,12.06 13.72,8.64 v13.84,8.51 | v18.92,13.84 13.84,8.76 v13.84,8.51 | v26.8,9.53 26.8,7.24 26.67,7.11 | R22.1 79.12,26.16 76.07,26.16 R18.1 75.82,26.16 72.52,26.16 R20.1 72.39,26.04 68.96,26.04 R21.1 68.83,25.91 66.04,25.91 R16.1 65.79,25.91 62.61,25.91 R15.1 62.36,25.91 59.31,25.91 R17.1 59.18,25.91 58.29,25.02 58.29,18.92 R19.1 58.17,18.8 57.53,18.16 57.53,17.02 62.61,11.94 v62.61,9.78 | v34.54,8.89 34.42,8.89

## Text on the board
Route2: Second star to the right and straight on 'til morning!
Document: MCAT-4CU-B Controller (Ver. 2E) / 4MAY14 GWU Micro-propulsion and Nanotechnology Lab / (c) George Washington University, 2014